# Altium schematic sheet 05_MCU-Part2.SchDoc
size A3; SheetNumber: 5; SheetTotal: 7
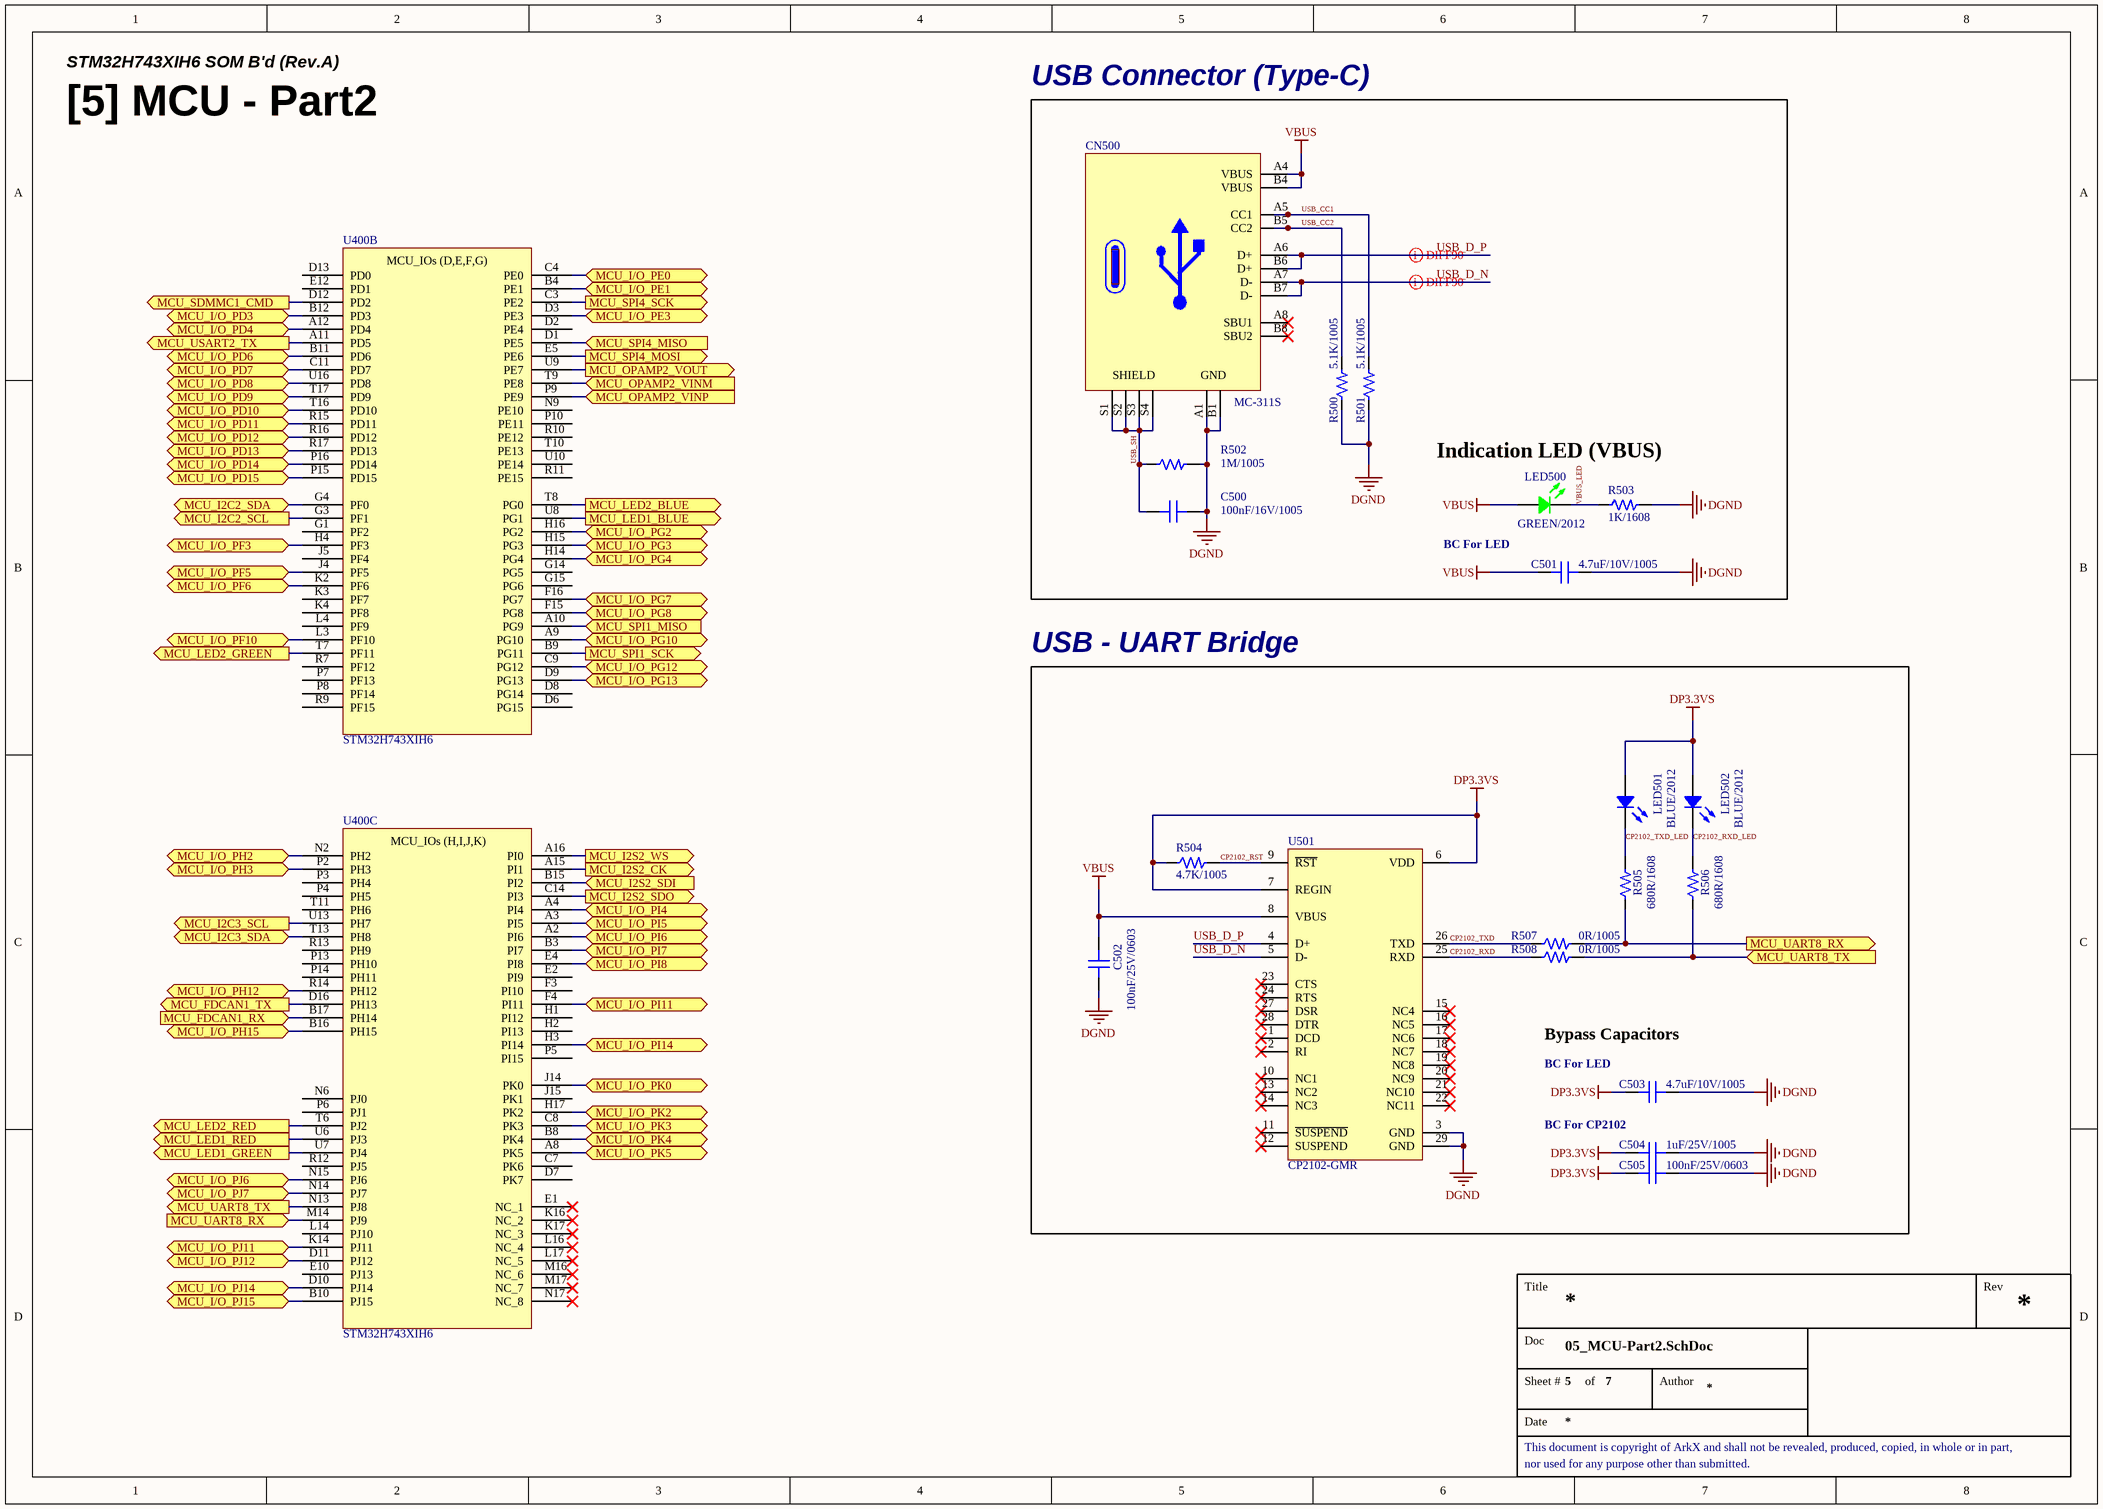
[diagram p0: 05_MCU-Part2.SchDoc]

## Parts
C500  100nF/16V/1005  [CAP 1005 (0402_INCH)]
C501  4.7uF/10V/1005  [CAP 1005 (0402_INCH)]
C502  100nF/25V/0603  [CAP 0603 (0201_INCH)]
C503  4.7uF/10V/1005  [CAP 1005 (0402_INCH)]
C504  1uF/25V/1005  [CAP 1005 (0402_INCH)]
C505  100nF/25V/0603  [CAP 0603 (0201_INCH)]
CN500  MC-311S  [CON USB-Type-C (16P)]
LED500  GREEN/2012  [LED MHT170RGBCT (GREEN)]
LED501  BLUE/2012  [LED MHT170RGBCT (BLUE)]
LED502  BLUE/2012  [LED MHT170RGBCT (BLUE)]
R500  5.1K/1005  [RES 1005 (0402_inch)]
R501  5.1K/1005  [RES 1005 (0402_inch)]
R502  1M/1005  [RES 1005 (0402_inch)]
R503  1K/1608  [RES 1608 (0603_inch)]
R504  4.7K/1005  [RES 1005 (0402_inch)]
R505  680R/1608  [RES 1608 (0603_inch)]
R506  680R/1608  [RES 1608 (0603_inch)]
R507  0R/1005  [RES 1005 (0402_inch)]
R508  0R/1005  [RES 1005 (0402_inch)]
U400  STM32H743XIH6  [IC TFBGA-265]  (parts B,C of 4)
U501  CP2102-GMR  [QFN-28 (5x5mm)]

## Blocks framed on the sheet
USB Connector (Type-C): C500 C501 CN500 LED500 R500-R503
USB - UART Bridge: C502-C505 LED501 LED502 R504-R508 U501

## Ports
MCU_FDCAN1_RX (in), MCU_FDCAN1_TX (out), MCU_I2C2_SCL (out), MCU_I2C2_SDA (bidir), MCU_I2C3_SCL (out), MCU_I2C3_SDA (bidir), MCU_I2S2_CK (out), MCU_I2S2_SDI (in), MCU_I2S2_SDO (out), MCU_I2S2_WS (out), MCU_I/O_PD3 (bidir), MCU_I/O_PD4 (bidir), MCU_I/O_PD6 (bidir), MCU_I/O_PD7 (bidir), MCU_I/O_PD8 (bidir), MCU_I/O_PD9 (bidir), MCU_I/O_PD10 (bidir), MCU_I/O_PD11 (bidir), MCU_I/O_PD12 (bidir), MCU_I/O_PD13 (bidir), MCU_I/O_PD14 (bidir), MCU_I/O_PD15 (bidir), MCU_I/O_PE0 (bidir), MCU_I/O_PE1 (bidir), MCU_I/O_PE3 (bidir), MCU_I/O_PF3 (bidir), MCU_I/O_PF5 (bidir), MCU_I/O_PF6 (bidir), MCU_I/O_PF10 (bidir), MCU_I/O_PG2 (bidir), MCU_I/O_PG3 (bidir), MCU_I/O_PG4 (bidir), MCU_I/O_PG7 (bidir), MCU_I/O_PG8 (bidir), MCU_I/O_PG10 (bidir), MCU_I/O_PG12 (bidir), MCU_I/O_PG13 (bidir), MCU_I/O_PH2 (bidir), MCU_I/O_PH3 (bidir), MCU_I/O_PH12 (bidir), MCU_I/O_PH15 (bidir), MCU_I/O_PI4 (bidir), MCU_I/O_PI5 (bidir), MCU_I/O_PI6 (bidir), MCU_I/O_PI7 (bidir), MCU_I/O_PI8 (bidir), MCU_I/O_PI11 (bidir), MCU_I/O_PI14 (bidir), MCU_I/O_PJ6 (bidir), MCU_I/O_PJ7 (bidir), MCU_I/O_PJ11 (bidir), MCU_I/O_PJ12 (bidir), MCU_I/O_PJ14 (bidir), MCU_I/O_PJ15 (bidir), MCU_I/O_PK0 (bidir), MCU_I/O_PK2 (bidir), MCU_I/O_PK3 (bidir), MCU_I/O_PK4 (bidir), MCU_I/O_PK5 (bidir), MCU_LED1_BLUE (out), MCU_LED1_GREEN (out), MCU_LED1_RED (out), MCU_LED2_BLUE (out), MCU_LED2_GREEN (out), MCU_LED2_RED (out), MCU_OPAMP2_VINM (in), MCU_OPAMP2_VINP (in), MCU_OPAMP2_VOUT (out), MCU_SDMMC1_CMD (out), MCU_SPI1_MISO (in), MCU_SPI1_SCK (out), MCU_SPI4_MISO (in), MCU_SPI4_MOSI (out), MCU_SPI4_SCK (out), MCU_UART8_RX (in), MCU_UART8_RX (out), MCU_UART8_TX (in), MCU_UART8_TX (out), MCU_USART2_TX (out)

## Nets
DGND: C500.1 C501.1 C502.2 C503.1 C504.2 C505.1 CN500.A1(GND) CN500.B1(GND) R500.1 R501.1 R502.2 R503.2 U501.3(GND) U501.29(GND)
DP3.3VS: C503.2 C504.1 C505.2 LED501.4(Common_Anode) LED502.4(Common_Anode) R504.1 U501.6(VDD) U501.7(REGIN)
VBUS: C501.2 C502.1 CN500.A4(VBUS) CN500.B4(VBUS) LED500.4(Common_Anode) U501.8(VBUS)
CP2102_RST: R504.2 U501.9(~{RST})
CP2102_RXD: R508.1 U501.25(RXD)
CP2102_RXD_LED: LED502.3(BLUE) R506.2
CP2102_TXD: R507.1 U501.26(TXD)
CP2102_TXD_LED: LED501.3(BLUE) R505.2
MCU_FDCAN1_RX: U400.B17(PH14) ; port MCU_FDCAN1_RX
MCU_FDCAN1_TX: U400.D16(PH13) ; port MCU_FDCAN1_TX
MCU_I2C2_SCL: U400.G3(PF1) ; port MCU_I2C2_SCL
MCU_I2C2_SDA: U400.G4(PF0) ; port MCU_I2C2_SDA
MCU_I2C3_SCL: U400.U13(PH7) ; port MCU_I2C3_SCL
MCU_I2C3_SDA: U400.T13(PH8) ; port MCU_I2C3_SDA
MCU_I2S2_CK: U400.A15(PI1) ; port MCU_I2S2_CK
MCU_I2S2_SDI: U400.B15(PI2) ; port MCU_I2S2_SDI
MCU_I2S2_SDO: U400.C14(PI3) ; port MCU_I2S2_SDO
MCU_I2S2_WS: U400.A16(PI0) ; port MCU_I2S2_WS
MCU_I/O_PD3: U400.B12(PD3) ; port MCU_I/O_PD3
MCU_I/O_PD4: U400.A12(PD4) ; port MCU_I/O_PD4
MCU_I/O_PD6: U400.B11(PD6) ; port MCU_I/O_PD6
MCU_I/O_PD7: U400.C11(PD7) ; port MCU_I/O_PD7
MCU_I/O_PD8: U400.U16(PD8) ; port MCU_I/O_PD8
MCU_I/O_PD9: U400.T17(PD9) ; port MCU_I/O_PD9
MCU_I/O_PD10: U400.T16(PD10) ; port MCU_I/O_PD10
MCU_I/O_PD11: U400.R15(PD11) ; port MCU_I/O_PD11
MCU_I/O_PD12: U400.R16(PD12) ; port MCU_I/O_PD12
MCU_I/O_PD13: U400.R17(PD13) ; port MCU_I/O_PD13
MCU_I/O_PD14: U400.P16(PD14) ; port MCU_I/O_PD14
MCU_I/O_PD15: U400.P15(PD15) ; port MCU_I/O_PD15
MCU_I/O_PE0: U400.C4(PE0) ; port MCU_I/O_PE0
MCU_I/O_PE1: U400.B4(PE1) ; port MCU_I/O_PE1
MCU_I/O_PE3: U400.D3(PE3) ; port MCU_I/O_PE3
MCU_I/O_PF3: U400.H4(PF3) ; port MCU_I/O_PF3
MCU_I/O_PF5: U400.J4(PF5) ; port MCU_I/O_PF5
MCU_I/O_PF6: U400.K2(PF6) ; port MCU_I/O_PF6
MCU_I/O_PF10: U400.L3(PF10) ; port MCU_I/O_PF10
MCU_I/O_PG2: U400.H16(PG2) ; port MCU_I/O_PG2
MCU_I/O_PG3: U400.H15(PG3) ; port MCU_I/O_PG3
MCU_I/O_PG4: U400.H14(PG4) ; port MCU_I/O_PG4
MCU_I/O_PG7: U400.F16(PG7) ; port MCU_I/O_PG7
MCU_I/O_PG8: U400.F15(PG8) ; port MCU_I/O_PG8
MCU_I/O_PG10: U400.A9(PG10) ; port MCU_I/O_PG10
MCU_I/O_PG12: U400.C9(PG12) ; port MCU_I/O_PG12
MCU_I/O_PG13: U400.D9(PG13) ; port MCU_I/O_PG13
MCU_I/O_PH2: U400.N2(PH2) ; port MCU_I/O_PH2
MCU_I/O_PH3: U400.P2(PH3) ; port MCU_I/O_PH3
MCU_I/O_PH12: U400.R14(PH12) ; port MCU_I/O_PH12
MCU_I/O_PH15: U400.B16(PH15) ; port MCU_I/O_PH15
MCU_I/O_PI4: U400.A4(PI4) ; port MCU_I/O_PI4
MCU_I/O_PI5: U400.A3(PI5) ; port MCU_I/O_PI5
MCU_I/O_PI6: U400.A2(PI6) ; port MCU_I/O_PI6
MCU_I/O_PI7: U400.B3(PI7) ; port MCU_I/O_PI7
MCU_I/O_PI8: U400.E4(PI8) ; port MCU_I/O_PI8
MCU_I/O_PI11: U400.F4(PI11) ; port MCU_I/O_PI11
MCU_I/O_PI14: U400.H3(PI14) ; port MCU_I/O_PI14
MCU_I/O_PJ6: U400.N15(PJ6) ; port MCU_I/O_PJ6
MCU_I/O_PJ7: U400.N14(PJ7) ; port MCU_I/O_PJ7
MCU_I/O_PJ11: U400.K14(PJ11) ; port MCU_I/O_PJ11
MCU_I/O_PJ12: U400.D11(PJ12) ; port MCU_I/O_PJ12
MCU_I/O_PJ14: U400.D10(PJ14) ; port MCU_I/O_PJ14
MCU_I/O_PJ15: U400.B10(PJ15) ; port MCU_I/O_PJ15
MCU_I/O_PK0: U400.J14(PK0) ; port MCU_I/O_PK0
MCU_I/O_PK2: U400.H17(PK2) ; port MCU_I/O_PK2
MCU_I/O_PK3: U400.C8(PK3) ; port MCU_I/O_PK3
MCU_I/O_PK4: U400.B8(PK4) ; port MCU_I/O_PK4
MCU_I/O_PK5: U400.A8(PK5) ; port MCU_I/O_PK5
MCU_LED1_BLUE: U400.U8(PG1) ; port MCU_LED1_BLUE
MCU_LED1_GREEN: U400.U7(PJ4) ; port MCU_LED1_GREEN
MCU_LED1_RED: U400.U6(PJ3) ; port MCU_LED1_RED
MCU_LED2_BLUE: U400.T8(PG0) ; port MCU_LED2_BLUE
MCU_LED2_GREEN: U400.T7(PF11) ; port MCU_LED2_GREEN
MCU_LED2_RED: U400.T6(PJ2) ; port MCU_LED2_RED
MCU_OPAMP2_VINM: U400.T9(PE8) ; port MCU_OPAMP2_VINM
MCU_OPAMP2_VINP: U400.P9(PE9) ; port MCU_OPAMP2_VINP
MCU_OPAMP2_VOUT: U400.U9(PE7) ; port MCU_OPAMP2_VOUT
MCU_SDMMC1_CMD: U400.D12(PD2) ; port MCU_SDMMC1_CMD
MCU_SPI1_MISO: U400.A10(PG9) ; port MCU_SPI1_MISO
MCU_SPI1_SCK: U400.B9(PG11) ; port MCU_SPI1_SCK
MCU_SPI4_MISO: U400.D1(PE5) ; port MCU_SPI4_MISO
MCU_SPI4_MOSI: U400.E5(PE6) ; port MCU_SPI4_MOSI
MCU_SPI4_SCK: U400.C3(PE2) ; port MCU_SPI4_SCK
MCU_UART8_RX: R505.1 R507.2 U400.M14(PJ9) ; port MCU_UART8_RX
MCU_UART8_TX: R506.1 R508.2 U400.N13(PJ8) ; port MCU_UART8_TX
MCU_USART2_TX: U400.A11(PD5) ; port MCU_USART2_TX
USB_CC1: CN500.A5(CC1) R501.2
USB_CC2: CN500.B5(CC2) R500.2
USB_D_N: CN500.A7(D-) CN500.B7(D-) U501.5(D-)
USB_D_P: CN500.A6(D+) CN500.B6(D+) U501.4(D+)
USB_SH: C500.2 CN500.S1(SHIELD) CN500.S2(SHIELD) CN500.S3(SHIELD) CN500.S4(SHIELD) R502.1
VBUS_LED: LED500.2(GREEN) R503.1

Not connected (* = marked no-connect by the designer): CN500 A8(SBU1)* B8(SBU2)*; U400 C7(PK6) D2(PE4) D6(PG15) D7(PK7) D8(PG14) D13(PD0) E1(NC_1)* E2(PI9) E10(PJ13) E12(PD1) F3(PI10) G1(PF2) G14(PG5) G15(PG6) H1(PI12) H2(PI13) J5(PF4) J15(PK1) K3(PF7) K4(PF8) K16(NC_2)* K17(NC_3)* L4(PF9) L14(PJ10) L16(NC_4)* L17(NC_5)* M16(NC_6)* M17(NC_7)* N6(PJ0) N9(PE10) N17(NC_8)* P3(PH4) P4(PH5) P5(PI15) P6(PJ1) P7(PF13) P8(PF14) P10(PE11) P13(PH10) P14(PH11) R7(PF12) R9(PF15) R10(PE12) R11(PE15) R12(PJ5) R13(PH9) T10(PE13) T11(PH6) U10(PE14); U501 1(DCD)* 2(RI)* 10(NC1)* 11(~{SUSPEND})* 12(SUSPEND)* 13(NC2)* 14(NC3)* 15(NC4)* 16(NC5)* 17(NC6)* 18(NC7)* 19(NC8)* 20(NC9)* 21(NC10)* 22(NC11)* 23(CTS)* 24(RTS)* 27(DSR)* 28(DTR)*

## Layout directives
differential pair; differential pair class DIFF90: USB_D_N, USB_D_P

## Notes on the sheet
- STM32H743XIH6 SOM B'd (Rev.A)
- [5] MCU - Part2
- Indication LED (VBUS)
- BC For LED
- Bypass Capacitors
- (near C503) BC For LED
- BC For CP2102
- Title
- Rev
- Doc
- Sheet #
- of
- Author
- This document is copyright of ArkX and shall not be revealed, produced, copied, in whole or in part,
- Date
- nor used for any purpose other than submitted.
- (in symbol IC_MCU_STM32H743XIH6, part B) MCU_IOs (D,E,F,G)
- (in symbol IC_MCU_STM32H743XIH6, part C) MCU_IOs (H,I,J,K)

## Library data of the parts
C500 = CAP_100nF/16V/1005: Ceramic CAP_100nF/16V/1005; LCSC Part #: C1525; JLCPCB Part Type: Basic Part
C501 C503 = CAP_4.7uF/10V/1005: 10V 4.7uF X5R ±20% 0402  Multilayer Ceramic Capacitors MLCC - SMD/SMT ROHS; JLCPCB Part Type: Basic Part; LCSC Part #: C23733
C502 C505 = CAP_100nF/25V/0603: Ceramic CAP_100nF/25V/0603; JLCPCB Part Type: Extended Part; LCSC Part #: C181047
C504 = CAP_1uF/25V/1005: Ceramic CAP_1uF/25V/1005; LCSC Part #: C52923; JLCPCB Part Type: Basic Part
CN500 = CON_USB-Type-C: USB 2.0 5A 1 Surface Mount 16 Female -35℃~+75℃ Type-C SMD  USB Connectors ROHS; LCSC Part #: C2977718; JLCPCB Part Type: Extended Part
LED500 = LED_MHT170RGBCT(GREEN): Colorless transparence -30℃~+85℃ Positive post Common anode RGB 120° 0805  Light Emitting Diodes (LED) ROHS; LCSC Part #: C2962094; JLCPCB Part Type: Extended Part
LED501 LED502 = LED_MHT170RGBCT(BLUE): Colorless transparence -30℃~+85℃ Positive post Common anode RGB 120° 0805  Light Emitting Diodes (LED) ROHS; LCSC Part #: C2962094; JLCPCB Part Type: Extended Part
R500 R501 = RES_5.1K/1005/62.5mW: Value: 5.1K; Power Rating: 62.5mW; Precision: 1%; Size: 1005; LCSC Part #: C25905; JLCPCB Part Type: Basic Part
R502 = RES_1M/1005/62.5mW: Value: 1M; Power Rating: 62.5mW; Precision: 1%; Size: 1005; LCSC Part #: C26083; JLCPCB Part Type: Basic Part
R503 = RES_1K/1608/0.1W: Value: 1K; Power Rating: 0.1W; Precision: 1%; Size: 1608; LCSC Part #: C21190; JLCPCB Part Type: Basic Part
R504 = RES_4.7K/1005/62.5mW: Value: 4.7K; Power Rating: 62.5mW; Precision: 1%; Size: 1005; LCSC Part #: C25900; JLCPCB Part Type: Basic Part
R505 R506 = RES_680R/1608/0.1W: Value: 680R; Power Rating: 0.1W; Precision: 1%; Size: 1608; LCSC Part #: C23228; JLCPCB Part Type: Basic Part
R507 R508 = RES_0R/1005/62.5mW: Value: 0R; Power Rating: 62.5mW; Precision: 1%; Size: 1005; LCSC Part #: C17168; JLCPCB Part Type: Basic Part
U400 = IC_MCU_STM32H743XIH6: ARM® Cortex®-M7 STM32H7 MCU IC 32bit Single-core 480MHz 2MB(2M x 8) Flash 240+25-TFBGA(14x14); LCSC Part #: C114407; JLCPCB Part Type: Extended Part
U501 = IC_USB_CP2102: Transceiver 1Mbps USB 1/1 QFN-28_5x5x05P  USB ICs ROHS; LCSC Part #: C6568; JLCPCB Part Type: Basic Part